# EAGLE schematic acdr_3.1 (EAGLE 7.7.0)
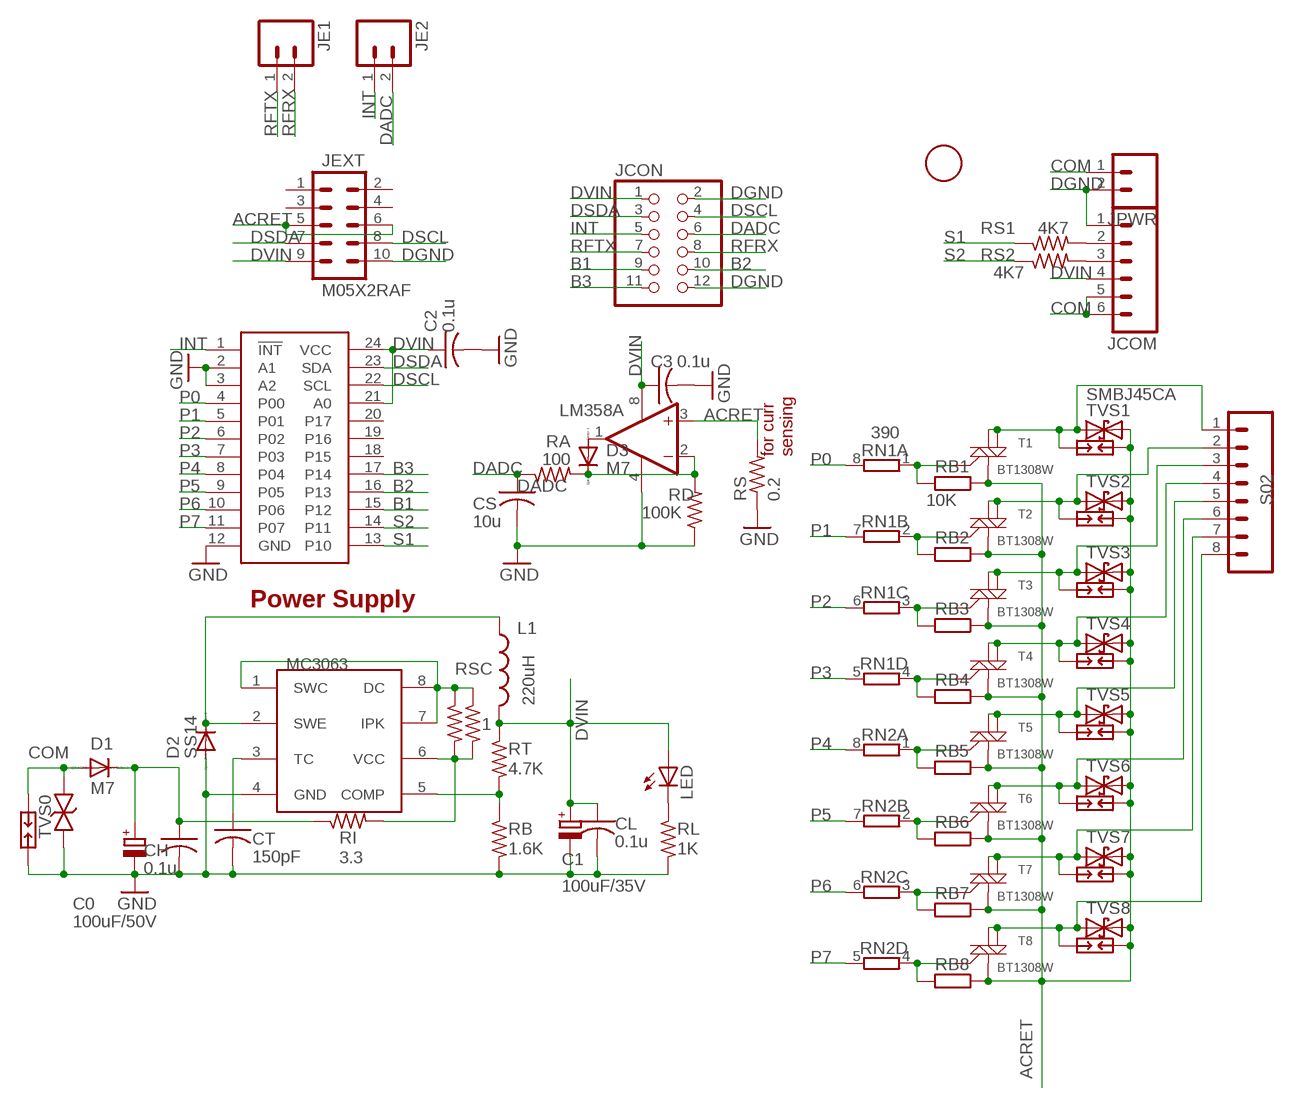
[diagram p0: schematic, sheet 1]

## Parts
1F  FIDUCIAL  [FIDUCIAL_1MM]
C0  100uF/50V  CPOL-EUE  [PANASONIC_E]
C1  100uF/35V  CPOL-EUD  [PANASONIC_D]
C2  0.1u  C-USC0603  [C0603]
C3  0.1u  C-USC0603  [C0603]
CH  0.1u  C-USC0603  [C0603]
CL  0.1u  C-USC0603  [C0603]
CS  10u  C-USC0805K  [C0805K]
CT  150pF  C-USC0603K  [C0603K]
D1  M7  DIODE-DO-214AC  [DO-214AC]
D2  SS14  DIODE-DO-214AC  [DO-214AC]
D3  M7  DIODE-DO-214AC  [DO-214AC]
JCOM  M065MM  [SCREWTERMINAL-5MM-6]
JCON  PINHD-2X6  [2X06]
JE1  M02PTH  [1X02]
JE2  M02PTH  [1X02]
JEXT  M05X2RAF  [2X5-RAF]
JPWR  M024MM-X  [SCREWTERMINAL-4MM-2-X]
L1  220uH  INDUCTORSRU1038  [SRU1038]
LED  LEDCHIPLED_0805  [CHIPLED_0805]
LM358  OP262D  [SO08]
MC3063  MC34063  MC33063/MC34063D  [SO08]
PCA9555  PCA9555  PCF8575TSSOP24  [TSSOP24]
RA  100  R-US_R0603  [R0603]
RB  1.6K  R-US_R0603  [R0603]
RB1  10K  R-EU_R0603  [R0603]
RB2  10K  R-EU_R0603  [R0603]
RB3  10K  R-EU_R0603  [R0603]
RB4  10K  R-EU_R0603  [R0603]
RB5  10K  R-EU_R0603  [R0603]
RB6  10K  R-EU_R0603  [R0603]
RB7  10K  R-EU_R0603  [R0603]
RB8  10K  R-EU_R0603  [R0603]
RD  100K  R-US_R0603  [R0603]
RI  3.3  R-US_R2010  [R2010]
RL  1K  R-US_R0603  [R0603]
RN1  390  4R-NEXB38V  [EXB38V]
RN2  390  4R-NEXB38V  [EXB38V]
RS  0.2  R-US_R2512  [R2512]
RS1  4K7  R-US_R0603  [R0603]
RS2  4K7  R-US_R0603  [R0603]
RSC  1  R-US_R0805  [R0805]
RSC1  1  R-US_R0805  [R0805]
RT  4.7K  R-US_R0603  [R0603]
S02  M085MM-8  [SCREWTERMINAL-5MM-8]
SP0  PCB-SGAP  [PCB-SGAP]
SP1  PCB-SGAP  [PCB-SGAP]
SP2  PCB-SGAP  [PCB-SGAP]
SP3  PCB-SGAP  [PCB-SGAP]
SP4  PCB-SGAP  [PCB-SGAP]
SP5  PCB-SGAP  [PCB-SGAP]
SP6  PCB-SGAP  [PCB-SGAP]
SP7  PCB-SGAP  [PCB-SGAP]
SP8  PCB-SGAP  [PCB-SGAP]
T1  BT1308W  MAC97SOT223  [SOT223]
T2  BT1308W  MAC97SOT223  [SOT223]
T3  BT1308W  MAC97SOT223  [SOT223]
T4  BT1308W  MAC97SOT223  [SOT223]
T5  BT1308W  MAC97SOT223  [SOT223]
T6  BT1308W  MAC97SOT223  [SOT223]
T7  BT1308W  MAC97SOT223  [SOT223]
T8  BT1308W  MAC97SOT223  [SOT223]
TVS0  SMBJ45CA  DIODE-BTVSSMB  [SMB]
TVS1  SMBJ45CA  TVSSMB  [SMB]
TVS2  SMBJ45CA  TVSSMB  [SMB]
TVS3  SMBJ45CA  TVSSMB  [SMB]
TVS4  SMBJ45CA  TVSSMB  [SMB]
TVS5  SMBJ45CA  TVSSMB  [SMB]
TVS6  SMBJ45CA  TVSSMB  [SMB]
TVS7  SMBJ45CA  TVSSMB  [SMB]
TVS8  SMBJ45CA  TVSSMB  [SMB]

## Nets
ACRET: JEXT.5 JEXT.6 LM358.3(A:+IN) RB1.1 RB2.1 RB3.1 RB4.1 RB5.1 RB6.1 RB7.1 RB8.1 RS.2 SP1.1 SP2.1 SP3.1 SP4.1 SP5.1 SP6.1 SP7.1 SP8.1 T1.1(M1) T2.1(M1) T3.1(M1) T4.1(M1) T5.1(M1) T6.1(M1) T7.1(M1) T8.1(M1) TVS1.C TVS2.C TVS3.C TVS4.C TVS5.C TVS6.C TVS7.C TVS8.C
B1: JCON.9 PCA9555.15(P12)
B2: JCON.10 PCA9555.16(P13)
B3: JCON.11 PCA9555.17(P14)
COM [power]: D1.A JCOM.5 JCOM.6 JPWR.1 SP0.1 TVS0.C
DADC [signal]: CS.1 JCON.6 JE2.2 RA.1
DGND [power]: C0.- C1.- C2.2 C3.2 CH.2 CL.2 CS.2 CT.2 D2.A JCOM.1 JCON.2 JCON.12 JEXT.10 JPWR.2 LM358.4(P:V-) MC3063.4(GND) PCA9555.2(A1) PCA9555.3(A2) PCA9555.12(GND) RB.2 RD.1 RL.2 RS.1 SP0.2 TVS0.A ; supply symbol labelled GND
DSCL [signal]: JCON.4 JEXT.8 PCA9555.22(SCL)
DSDA [signal]: JCON.3 JEXT.7 PCA9555.23(SDA)
DVIN [power]: C1.+ C2.1 C3.1 CL.1 JCOM.4 JCON.1 JEXT.9 L1.2 LED.A LM358.8(P:V+) PCA9555.21(A0) PCA9555.24(VCC) RT.1
INT [signal]: JCON.5 JE2.1 PCA9555.1(!INT)
N$1 [power]: MC3063.1(SWC) MC3063.7(IPK) MC3063.8(DC) RSC1.1 RSC.1
N$2: JCOM.2 RS1.2
N$3: JCOM.3 RS2.2
N$7: D3.C LM358.2(A:-IN) RA.2 RD.2
N$8: RB1.2 RN1.1 T1.3(G)
N$9: RB2.2 RN1.2 T2.3(G)
N$15: RB3.2 RN1.3 T3.3(G)
N$16: RB4.2 RN1.4 T4.3(G)
N$17 [power]: D2.C L1.1 MC3063.2(SWE)
N$18: RB5.2 RN2.1 T5.3(G)
N$19: RB6.2 RN2.2 T6.3(G)
N$21: RB7.2 RN2.3 T7.3(G)
N$22: RB8.2 RN2.4 T8.3(G)
N$24: CT.1 MC3063.3(TC)
N$26: MC3063.5(COMP) RB.1 RT.2
N$27 [power]: MC3063.6(VCC) RI.2 RSC1.2 RSC.2
N$28: LED.C RL.1
N$43: D3.A LM358.1(A:OUT)
N$50 [power]: S02.1 SP1.2 T1.2(M2) T1.4(M2-4) TVS1.A
N$51 [power]: S02.2 SP2.2 T2.2(M2) T2.4(M2-4) TVS2.A
N$52 [power]: S02.3 SP3.2 T3.2(M2) T3.4(M2-4) TVS3.A
N$53 [power]: S02.4 SP4.2 T4.2(M2) T4.4(M2-4) TVS4.A
N$54 [power]: S02.5 SP5.2 T5.2(M2) T5.4(M2-4) TVS5.A
N$55 [power]: S02.6 SP6.2 T6.2(M2) T6.4(M2-4) TVS6.A
N$56 [power]: S02.7 SP7.2 T7.2(M2) T7.4(M2-4) TVS7.A
N$57 [power]: S02.8 SP8.2 T8.2(M2) T8.4(M2-4) TVS8.A
P0: PCA9555.4(P00) RN1.8
P1: PCA9555.5(P01) RN1.7
P2: PCA9555.6(P02) RN1.6
P3: PCA9555.7(P03) RN1.5
P4: PCA9555.8(P04) RN2.8
P5: PCA9555.9(P05) RN2.7
P6: PCA9555.10(P06) RN2.6
P7: PCA9555.11(P07) RN2.5
RECAC [power]: C0.+ CH.1 D1.C RI.1
RFRX: JCON.8 JE1.2
RFTX: JCON.7 JE1.1
S1 [signal]: PCA9555.13(P10) RS1.1
S2 [signal]: PCA9555.14(P11) RS2.1
Unconnected: JEXT.1 JEXT.2 JEXT.3 JEXT.4 LM358.5(B:+IN) LM358.6(B:-IN) LM358.7(B:OUT) PCA9555.18(P15) PCA9555.19(P16) PCA9555.20(P17)

## Notes on the sheet
- for curr
  sensing
- Power Supply

## Library data of the parts
1F = adafruitGood:FIDUCIAL: For use by pick and place machines to calibrate the vision/machine, 1mm By microbuilder.eu
C0 C1 = resistor:CPOL-EU: POLARIZED CAPACITOR, European symbol
C2 C3 CH CL CS CT = adafruit:C-US: CAPACITOR, American symbol
D1-D3 = diode:DIODE-: DIODE
JCOM = SparkFun:M06: Header 6 Standard 6-pin 0.1" header. Use with straight break away headers (SKU : PRT-00116), right angle break away headers (PRT-00553), swiss pins (PRT-00743), machine pins (PRT-00117), and female headers (PRT-00115). Molex polarized connector foot print use with SKU : PRT-08094 with associated crimp pins and housings. NOTES ON THE VARIANTS LOCK and LOCK_LONGPADS... This footprint was designed to help hold the alignment of a through-hole component (i.e. 6-pin header) while soldering it into place. You may notice that each hole has been shifted either up or down by 0.005 of an inch from it's more standard position (which is a perfectly straight line). This slight alteration caused the pins (the squares in the middle) to touch the edges of the holes. Because they are alternating, it causes a "brace" to hold the component in place. 0.005 has proven to be the perfect amount of "off-center" position when using our standard breakaway headers. Although looks a little odd when you look at the bare footprint, once you have a header in there, the alteration is very hard to notice. Also, if you push a header all the way into place, it is covered up entirely on the bottom side. This idea of altering the position of holes to aid alignment will be further integrated into the Sparkfun Library for other footprints. It can help hold any component with 3 or more connection pins.
JCON = pinhead:PINHD-2X6: PIN HEADER
JE1 JE2 = SparkFunNew:M02: Header 2 Standard 2-pin 0.1" header. Use with straight break away headers (SKU : PRT-00116), right angle break away headers (PRT-00553), swiss pins (PRT-00743), machine pins (PRT-00117), and female headers (PRT-00115). Molex polarized connector foot print use with SKU : PRT-08233 with associated crimp pins and housings.
JEXT = SparkFunNew:M05X2: Header 5x2 Standard 10-pin dual row 0.1" header. Commonly used with AVR-ISP. Use with Spark Fun Electronics SKU: PRT-00778
JPWR = SparkFun:M02: Header 2 Standard 2-pin 0.1" header. Use with straight break away headers (SKU : PRT-00116), right angle break away headers (PRT-00553), swiss pins (PRT-00743), machine pins (PRT-00117), and female headers (PRT-00115). Molex polarized connector foot print use with SKU : PRT-08233 with associated crimp pins and housings.
L1 = SparkFunNew:INDUCTOR: Inductors Basic Inductor/Choke - 0603 and 1206. Footprints are not proven and vary greatly between part numbers.
LED = adafruit:LED: LED OSRAM: - CHIPLED LG R971, LG N971, LY N971, LG Q971, LY Q971, LO R971, LY R971 LH N974, LH R974 LS Q976, LO Q976, LY Q976 LO Q996 - Hyper CHIPLED LW Q18S LB Q993, LB Q99A, LB R99A - SideLED LS A670, LO A670, LY A670, LG A670, LP A670 LB A673, LV A673, LT A673, LW A673 LH A674 LY A675 LS A676, LA A676, LO A676, LY A676, LW A676 LS A679, LY A679, LG A679 - Hyper Micro SIDELED® LS Y876, LA Y876, LO Y876, LY Y876 LT Y87S - SmartLED LW L88C, LW L88S LB L89C, LB L89S, LG L890 LS L89K, LO L89K, LY L89K LS L896, LA L896, LO L896, LY L896 - TOPLED LS T670, LO T670, LY T670, LG T670, LP T670 LSG T670, LSP T670, LSY T670, LOP T670, LYG T670 LG T671, LOG T671, LSG T671 LB T673, LV T673, LT T673, LW T673 LH T674 LS T676, LA T676, LO T676, LY T676, LB T676, LH T676, LSB T676, LW T676 LB T67C, LV T67C, LT T67C, LS T67K, LO T67K, LY T67K, LW E67C LS E67B, LA E67B, LO E67B, LY E67B, LB E67C, LV E67C, LT E67C LW T67C LS T679, LY T679, LG T679 LS T770, LO T770, LY T770, LG T770, LP T770 LB T773, LV T773, LT T773, LW T773 LH T774 LS E675, LA E675, LY E675, LS T675 LS T776, LA T776, LO T776, LY T776, LB T776 LHGB T686 LT T68C, LB T68C - Hyper Mini TOPLED® LB M676 - Mini TOPLED Santana® LG M470 LS M47K, LO M47K, LY M47K Source: http://www.osram.convergy.de/
LM358 = linear:OP262: OP AMP
MC3063 = adafruit:MC33063/MC34063: MC33063 and MC34063 Basic DC/DC converter with internal power-NPN transistor, 100KHz, 1.5A peak switch current. 3-40 input/output.
PCA9555 = SparkFunNew:PCF8575
RA RD RL RS RS1 RS2 = adafruit2013:R-US_: RESISTOR, American symbol
RB RI RSC RSC1 RT = adafruitGood:R-US_: RESISTOR, American symbol
RB1-RB8 = rcl:R-EU_: RESISTOR, European symbol
RN1 RN2 = resistor-dil:4R-N: Array Chip Resistor Source: RS Component / Phycomp; OC_FARNELL: unknown; OC_NEWARK: unknown
S02 = SparkFun:M08: Header 8 Standard 8-pin 0.1" header. Use with straight break away headers (SKU : PRT-00116), right angle break away headers (PRT-00553), swiss pins (PRT-00743), machine pins (PRT-00117), and female headers (PRT-00115).
SP0 SP1-SP8 = varistor:PCB-SGAP
T1-T8 = SparkFun:MAC97: MAC97 Triac http://www.onsemi.com/pub_link/Collateral/MAC97-D.PDF
TVS0 = diode:DIODE-BTVS
TVS1-TVS8 = SparkFunNew:TVS

## Net classes
0 default: width 0.203 mm, clearance 0.178 mm
1 power: width 0.203 mm, clearance 0.178 mm
2 relaypower: width 0.203 mm, clearance 0.178 mm
3 signal: width 0.203 mm, clearance 0.178 mm
4 adc: width 0.406 mm, clearance 0.178 mm